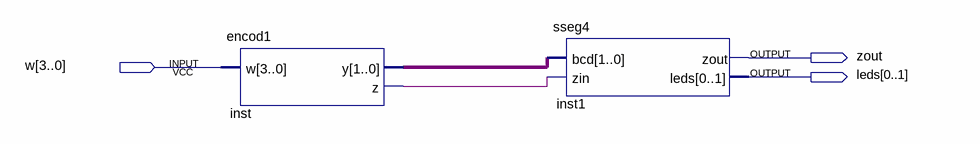
[diagram p0: schematic sheet]
// Quartus schematic encodcirc.bdf as structural Verilog: 2 symbols, 3 pins
module encodcirc (
  input  [3:0] w,
  output zout,
  output [0:1] leds
);

  wire inst_z;
  wire [1:0] inst_y;

  encod1 inst (.w(w), .y(inst_y), .z(inst_z));
  sseg4 inst1 (.bcd(inst_y), .zin(inst_z), .zout(zout), .leds(leds));
endmodule
